# Altium schematic sheet BLE_SCH_Rev1.SchDoc
size B; CompanyName: Microchip Technology Inc.; Organization: Microchip Technology; Address1: 2355 West Chandler Blvd.; Address2: Chandler, AZ  85224; Address4: USA; SheetNumber: 1; SheetTotal: 1; SheetTitle: **; Time: Time
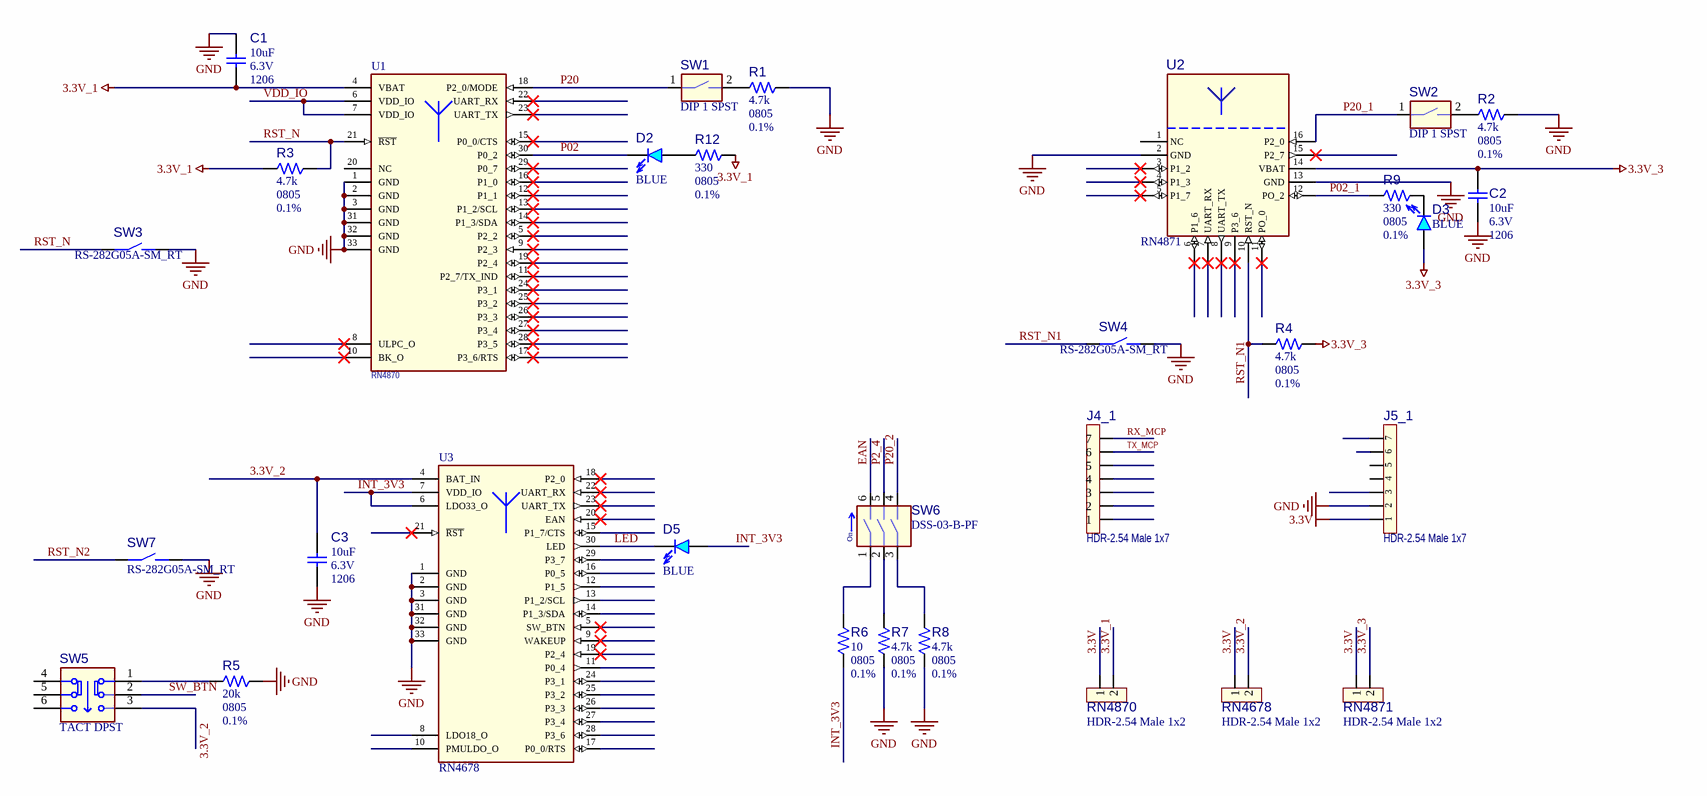
[diagram p0: BLE_SCH_Rev1.SchDoc]

## Parts
C1  value 10uF  Voltage: 6.3V  Package: 1206  [CAP_C_1206]  (hidden comment: Capacitor NP)
C2  value 10uF  Voltage: 6.3V  Package: 1206  [CAP_C_1206]  (hidden comment: Capacitor NP)
C3  value 10uF  Voltage: 6.3V  Package: 1206  [CAP_C_1206]  (hidden comment: Capacitor NP)
D2  value BLUE  [LED_0805_BLUE]  (hidden comment: LED_blue)
D3  value BLUE  [LED_0805_BLUE]  (hidden comment: LED_blue)
D5  value BLUE  [LED_0805_BLUE]  (hidden comment: LED_blue)
J4_1  value HDR-2.54 Male 1x7  [HDR_M_2.54_1x7]  (hidden comment: Header 1x7)
J5_1  value HDR-2.54 Male 1x7  [HDR_M_2.54_1x7]  (hidden comment: Header 1x7)
R1  value 4.7k  Package: 0805  Tolerance: 0.1%  [RES_C_0805]  (hidden comment: Resistor)
R2  value 4.7k  Package: 0805  Tolerance: 0.1%  [RES_C_0805]  (hidden comment: Resistor)
R3  value 4.7k  Package: 0805  Tolerance: 0.1%  [RES_C_0805]  (hidden comment: Resistor)
R4  value 4.7k  Package: 0805  Tolerance: 0.1%  [RES_C_0805]  (hidden comment: Resistor)
R5  value 20k  Package: 0805  Tolerance: 0.1%  [RES_C_0805]  (hidden comment: Resistor)
R6  value 10  Package: 0805  Tolerance: 0.1%  [RES_C_0805]  (hidden comment: Resistor)
R7  value 4.7k  Package: 0805  Tolerance: 0.1%  [RES_C_0805]  (hidden comment: Resistor)
R8  value 4.7k  Package: 0805  Tolerance: 0.1%  [RES_C_0805]  (hidden comment: Resistor)
R9  value 330  Package: 0805  Tolerance: 0.1%  [RES_C_0805]  (hidden comment: Resistor)
R12  value 330  Package: 0805  Tolerance: 0.1%  [RES_C_0805]  (hidden comment: Resistor)
RN4678  value HDR-2.54 Male 1x2  [HDR_M_2.54_1x2]  (hidden comment: Header 1x2)
RN4870  value HDR-2.54 Male 1x2  [HDR_M_2.54_1x2]  (hidden comment: Header 1x2)
RN4871  value HDR-2.54 Male 1x2  [HDR_M_2.54_1x2]  (hidden comment: Header 1x2)
SW1  value DIP 1 SPST  [SW_TH_2.54MM X 1 418117270901]  (hidden comment: Switch DIP 1 Pos)
SW2  value DIP 1 SPST  [SW_TH_2.54MM X 1 418117270901]  (hidden comment: Switch DIP 1 Pos)
SW3  value RS-282G05A-SM_RT  [SW_TACT_SMD_CK_RS-282G05A3-SM RT]  (hidden comment: Switch 2 Pin)
SW4  value RS-282G05A-SM_RT  [SW_TACT_SMD_CK_RS-282G05A3-SM RT]  (hidden comment: Switch 2 Pin)
SW5  value TACT DPST  [SW_TACT_TH_PS07-22L-PF]  (hidden comment: Switch on-off 6 Pin)
SW6  value DSS-03-B-PF  [SW_TH_2.54MM X 3 Omron]  (hidden comment: Switch DIP 3 Pos)
SW7  value RS-282G05A-SM_RT  [SW_TACT_SMD_CK_RS-282G05A3-SM RT]  (hidden comment: Switch 2 Pin)
U1  value RN4870  [MOD_BM70BLES1FC2]  (hidden comment: MODULE BM70BLES1FC2)
U2  value RN4871  [RN4871 MODULE-16]  (hidden comment: RN4871 MODULE)
U3  value RN4678  [MOD_BM78SPPS5xC2]  (hidden comment: MODULE BM78SPPS5xC2)

## Nets
3.3V: J5_1.1 RN4678.1 RN4870.1 RN4871.1
3.3V_1: C1.1 R3.2 R12.2 RN4870.2 U1.4(VBAT)
3.3V_3: C2.1 D3.1(A) R4.1 RN4871.2 U2.14(VBAT)
GND: C1.2 C2.2 C3.1 J5_1.2 R1.1 R2.1 R5.1 R7.2 R8.2 SW3.2 SW4.2 SW7.2 U1.1(GND) U1.2(GND) U1.3(GND) U1.31(GND) U1.32(GND) U1.33(GND) U2.2(GND) U2.13(GND) U3.1(GND) U3.2(GND) U3.3(GND) U3.31(GND) U3.32(GND) U3.33(GND)
3.3V_2: C3.2 RN4678.2 SW5.3 U3.4(BAT_IN)
EAN: SW6.6
INT_3V3: D5.1(A) R6.2 U3.6(LDO33_O) U3.7(VDD_IO)
LED: D5.2(K) U3.30(LED)
P02: D2.2(K) U1.30(P0_2)
P02_1: R9.1 U2.12(PO_2)
P2_4: SW6.5
P20: SW1.1 U1.18(P2_0/MODE)
P20_1: SW2.1 U2.16(P2_0)
P20_2: SW6.4
RST_N: R3.1 SW3.1 U1.21(~{RST})
RST_N1: R4.2 SW4.1 U2.10(RST_N)
RST_N2: SW7.1
RX_MCP: J4_1.7
SW_BTN: SW5.2
TX_MCP: J4_1.6
VDD_IO: U1.6(VDD_IO) U1.7(VDD_IO)
NetD2_1: D2.1(A) R12.1
NetD3_2: D3.2(K) R9.2
NetR1_2: R1.2 SW1.2
NetR2_2: R2.2 SW2.2
NetR5_2: R5.2 SW5.1
NetR6_1: R6.1 SW6.1
NetR7_1: R7.1 SW6.2
NetR8_1: R8.1 SW6.3

Not connected (* = marked no-connect by the designer): J4_1 1 2 3 4 5; J5_1 3 4 5 6 7; SW5 4 5 6; U1 5(P2_2)* 8(ULPC_O)* 9(P2_3)* 10(BK_O)* 11(P2_7/TX_IND)* 12(P1_1)* 13(P1_2/SCL)* 14(P1_3/SDA)* 15(P0_0/CTS)* 16(P1_0)* 17(P3_6/RTS)* 19(P2_4)* 20(NC) 22(UART_RX)* 23(UART_TX)* 24(P3_1)* 25(P3_2)* 26(P3_3)* 27(P3_4)* 28(P3_5)* 29(P0_7)*; U2 1(NC) 3(P1_2)* 4(P1_3)* 5(P1_7)* 6(P1_6)* 7(UART_RX)* 8(UART_TX)* 9(P3_6)* 11(PO_0)* 15(P2_7)*; U3 5(SW_BTN)* 8(LDO18_O) 9(WAKEUP)* 10(PMULDO_O) 11(P0_4) 12(P1_5) 13(P1_2/SCL) 14(P1_3/SDA) 15(P1_7/CTS) 16(P0_5) 17(P0_0/RTS) 18(P2_0)* 19(P2_4)* 20(EAN)* 21(~{RST})* 22(UART_RX)* 23(UART_TX)* 24(P3_1) 25(P3_2) 26(P3_3) 27(P3_4) 28(P3_6) 29(P3_7)

## Notes on the sheet
- Project Owner:
- PCB Layout Contact:
- PartNumber:
- Project Title
- Variant:
- Sheet Title
- Size
- B
- SCH #:
- PCB #:
- Rev:
- Date:
- Sheet
- Designed with
- Altium.com <http://go.altium.com/MicrochipLandingPage_Evaluation.html>
- File:
- (in symbol SWITCH1042) On

## Library data of the parts
C1-C3 = CAP0461: Manufacturer 1: Murata; Manufacturer Part Number 1: GRM31CR60J107ME39L; Description_: CAP CER 100uF 6.3V 20% X5R SMD 1206; Dev Tools Status: Production; Tolerance: 20%; Temperature Coefficient: X5R; Type: Ceramic; Populated: Yes; MCHP-ID: CAP0461; Revision: 1; Symbol: Capacitor NP; Status: MCL Design; ComponentLink1URL: https://chn-vm-apps.microchip.com/mchprepo/parts/Datasheets/L0005E.pdf; ComponentLink1Description: SVN Datasheet; ComponentLink2URL: C:\ALTIUM_WORK\00001_MCHP-CDB\Datasheets\L0005E.pdf; ComponentLink2Description: Local Datasheet; ComponentLink3URL: C:\ALTIUM_WORK\00001_MCHP-CDB\Library\LibraryRefs\Capacitor NP.SchLib; ComponentLink3Description: Open Symbol; ComponentLink4URL: C:\ALTIUM_WORK\00001_MCHP-CDB\Library\Footprints\CAP_C_1206.PcbLib; ComponentLink4Description: Open Footprint; ComponentLink5Description: Open Footprint 2; ComponentLink6Description: Open Footprint 3; ComponentLink7Description: Open Footprint 4; Operating Temperature: -55C to +85C; Category: Capacitor; Manufacturer 2: Taiyo Yuden; Manufacturer Part Number 2: JMK316BJ107ML-T; Supplier 1: Digi-Key; Supplier Part Number 1: 490-4539-1-ND; Supplier 2: Digi-Key; Supplier Part Number 2: 587-1963-1-ND; Quantity Override: 1
D2 D3 D5 = DIODE1080: LED; MCHP-ID: DIODE1080
J4_1 = CON0448: Manufacturer 1: Wurth Electronics Inc; Manufacturer Part Number 1: 61300711121; Description_: CON HDR-2.54 Male 1x7 Gold 5.84MH TH VERT; Dev Tools Status: Production; Populated: Yes; MCHP-ID: CON0448; Revision: 1; Symbol: Header 1x7; Status: MCL Design; ComponentLink1URL: https://chn-vm-apps.microchip.com/mchprepo/parts/Datasheets/TSW-XXX-XX-XXX-X-XX-XXX-MKT.pdf; ComponentLink1Description: SVN Datasheet; ComponentLink2URL: C:\ALTIUM_WORK\00001_MCHP-CDB\Datasheets\TSW-XXX-XX-XXX-X-XX-XXX-MKT.pdf; ComponentLink2Description: Local Datasheet; ComponentLink3URL: C:\ALTIUM_WORK\00001_MCHP-CDB\Library\LibraryRefs\Header 1x7.SchLib; ComponentLink3Description: Open Symbol; ComponentLink4URL: C:\ALTIUM_WORK\00001_MCHP-CDB\Library\Footprints\HDR_M_2.54_1x7.PcbLib; ComponentLink4Description: Open Footprint; ComponentLink5Description: Open Footprint 2; ComponentLink6Description: Open Footprint 3; ComponentLink7Description: Open Footprint 4; Type: Header 2.54mm; Category: Connector; Manufacturer 2: Samtec; Manufacturer Part Number 2: TSW-107-07-S-S; Manufacturer 3: Samtec; Manufacturer Part Number 3: TSW-107-07-G-S; Supplier 1: Digi-Key; Supplier Part Number 1: 732-5320-ND; Supplier 2: Digi-Key; Supplier Part Number 2: SAM1033-07-ND; Supplier 3: Samtec; Supplier Part Number 3: TSW-107-07-G-S; Quantity Override: 1
J5_1 = CON0448: Manufacturer 1: Samtec; Manufacturer Part Number 1: TSW-107-07-S-S; Description_: CON HDR-2.54 Male 1x7 Gold 5.84MH TH VERT; Populated: Yes; MCHP-ID: CON0448; Revision: 1; Status: Production; ComponentLink1URL: https://chn-vm-apps.microchip.com/mchprepo/parts/Datasheets/TSW-XXX-XX-XXX-X-XX-XXX-MKT.pdf; ComponentLink1Description: Datasheet; Type: Header 2.54mm; Category: Connector; Manufacturer 2: Samtec; Manufacturer Part Number 2: TSW-107-07-G-S; Supplier 1: Samtec; Supplier Part Number 1: TSW-107-07-S-S; Supplier 2: Samtec; Supplier Part Number 2: TSW-107-07-G-S; Quantity Override: 1
R1-R9 R12 = RES1372: MCHP-ID: RES1372
RN4678 RN4870 RN4871 = CON1312: Manufacturer 1: Sullins Connector Solutions; Manufacturer Part Number 1: PREC002SAAN-RC; Description_: CON HDR-2.54 Male 1x2 Tin 5.84MH TH VERT; Dev Tools Status: Production; Owner: Randolph Sobrepena; Populated: YES; Restricted Sourcing: No; MCHP-ID: CON1312; Revision: 3; Symbol: Header 1x2; Status: MCL Design; ComponentLink1URL: https://chn-vm-apps.microchip.com/mchprepo/parts/Datasheets/z RzCzzzSzzN-RC, ST,11635-B.pdf; ComponentLink1Description: SVN Datasheet; ComponentLink2URL: C:\ALTIUM_WORK\00001_MCHP-CDB\Datasheets\z RzCzzzSzzN-RC, ST,11635-B.pdf; ComponentLink2Description: Local Datasheet; ComponentLink3URL: C:\ALTIUM_WORK\00001_MCHP-CDB\Library\LibraryRefs\Header 1x2.SchLib; ComponentLink3Description: Open Symbol; ComponentLink4URL: C:\ALTIUM_WORK\00001_MCHP-CDB\Library\Footprints\HDR_M_2.54_1x2.PcbLib; ComponentLink4Description: Open Footprint; ComponentLink5Description: Open Footprint 2; ComponentLink6Description: Open Footprint 3; ComponentLink7Description: Open Footprint 4; Type: Header 2.54mm; Category: Connector; Manufacturer 2: SHENZHEN JUNHAO ENGINEERING; Manufacturer Part Number 2: R-211-0211-0021-000; Supplier 1: Digi-Key; Supplier Part Number 1: S1012EC-02-ND; Supplier 2: SHENZHEN JUNHAO ENGINEERING; Supplier Part Number 2: R-211-0211-0021-000; Quantity Override: 1
SW1 SW2 = SWITCH1055: Manufacturer 1: Würth Elektronik; Manufacturer Part Number 1: 418117270901; Description_: SWITCH DIP 1 SPST 24V 25mA 418117270901 TH; Dev Tools Status: Production; Owner: Gabor Bihari; Voltage: 24V; Current: 25mA; Populated: YES; MCHP-ID: SWITCH1055; Revision: 2; Symbol: Switch DIP 1 Pos; Status: MCL Design; ComponentLink1URL: https://chn-vm-apps.microchip.com/mchprepo/parts/Datasheets/4181172709xx.pdf; ComponentLink1Description: SVN Datasheet; ComponentLink2URL: C:\ALTIUM_WORK\00001_MCHP-CDB\Datasheets\4181172709xx.pdf; ComponentLink2Description: Local Datasheet; ComponentLink3URL: C:\ALTIUM_WORK\00001_MCHP-CDB\Library\LibraryRefs\Switch DIP 1 Pos.SchLib; ComponentLink3Description: Open Symbol; ComponentLink4URL: C:\ALTIUM_WORK\00001_MCHP-CDB\Library\Footprints\SW_TH_2.54MM X 1 418117270901.PcbLib; ComponentLink4Description: Open Footprint; ComponentLink5Description: Open Footprint 2; ComponentLink6Description: Open Footprint 3; ComponentLink7Description: Open Footprint 4; Operating Temperature: -40°C to 85°C; Category: Switch; Type: DIP; Supplier 1: Digi-Key; Supplier Part Number 1: 732-3831-5-ND; Quantity Override: 1
SW3 SW4 SW7 = SWITCH1057: Switch; Manufacturer 1: C&K; Manufacturer Part Number 1: KSR211GLFS; Description_: SWITCH TACT SPST 12V 50mA RS-282G05A3-SM RT; Dev Tools Status: Production; Owner: Gabor Bihari; Voltage: 12V; Current: 50mA; Populated: YES; MCHP-ID: SWITCH1057; Revision: 2; Symbol: Switch 2 Pin; Status: MCL Design; ComponentLink1URL: https://chn-vm-apps.microchip.com/mchprepo/parts/Datasheets/RS-282G05A-SM_RT.pdf; ComponentLink1Description: SVN Datasheet; ComponentLink2URL: C:\ALTIUM_WORK\00001_MCHP-CDB\Datasheets\RS-282G05A-SM_RT.pdf; ComponentLink2Description: Local Datasheet; ComponentLink3URL: C:\ALTIUM_WORK\00001_MCHP-CDB\Library\LibraryRefs\Switch 2 Pin.SchLib; ComponentLink3Description: Open Symbol; ComponentLink4URL: C:\ALTIUM_WORK\00001_MCHP-CDB\Library\Footprints\SW_TACT_SMD_CK_RS-282G05A3-SM RT.PcbLib; ComponentLink4Description: Open Footprint; ComponentLink5Description: Open Footprint 2; ComponentLink6Description: Open Footprint 3; ComponentLink7Description: Open Footprint 4; Category: Switch; Type: Tactile; Manufacturer 2: C&K Components; Manufacturer Part Number 2: RS-282G05A3-SM RT; Supplier 1: C&K; Supplier Part Number 1: KSR211GLFS; Supplier 2: Digi-Key; Supplier Part Number 2: CKN10384CT-ND; Quantity Override: 1
SW5 = SWITCH1041: PS-5177; Manufacturer 1: E-Switch; Manufacturer Part Number 1: TL2230OAF140; Description_: SWITCH TACTILE PUSH ON-OFF 6 PIN; Dev Tools Status: Production; Owner: Duane Burt; Populated: YES; MCHP-ID: SWITCH1041; Revision: 2; Symbol: Switch on-off 6 Pin; Status: MCL Design; ComponentLink1Description: SVN Datasheet; ComponentLink2Description: Local Datasheet; ComponentLink3URL: C:\ALTIUM_WORK\00001_MCHP-CDB\Library\LibraryRefs\Switch on-off 6 Pin.SchLib; ComponentLink3Description: Open Symbol; ComponentLink4URL: C:\ALTIUM_WORK\00001_MCHP-CDB\Library\Footprints\SW_TACT_TH_PS07-22L-PF.PcbLib; ComponentLink4Description: Open Footprint; ComponentLink5Description: Open Footprint 2; ComponentLink6Description: Open Footprint 3; ComponentLink7Description: Open Footprint 4; Category: Switch; Type: Tactile; Supplier 1: E-Switch; Supplier Part Number 1: TL2230OAF140; Quantity Override: 1
SW6 = SWITCH1042: Switch DIP; Manufacturer 1: C&K; Manufacturer Part Number 1: BDB03; Description_: SWITCH DIP 3 SPST 24VDC 25MA DSS-03-B-PF TH; Dev Tools Status: Production; Owner: Duane Burt; Populated: YES; MCHP-ID: SWITCH1042; Revision: 4; Symbol: Switch DIP 3 Pos; Status: MCL Design; ComponentLink1Description: SVN Datasheet; ComponentLink2Description: Local Datasheet; ComponentLink3URL: C:\ALTIUM_WORK\00001_MCHP-CDB\Library\LibraryRefs\Switch DIP 3 Pos.SchLib; ComponentLink3Description: Open Symbol; ComponentLink4URL: C:\ALTIUM_WORK\00001_MCHP-CDB\Library\Footprints\SW_TH_2.54MM X 3 Omron.PcbLib; ComponentLink4Description: Open Footprint; ComponentLink5Description: Open Footprint 2; ComponentLink6Description: Open Footprint 3; ComponentLink7Description: Open Footprint 4; Category: Switch; Type: DIP; Manufacturer 2: DIPTRONICS MANUFACTURING INC; Manufacturer Part Number 2: NDS-03V; Manufacturer 3: ROKI ELECTRONICS CO., LTD.; Manufacturer Part Number 3: DSS-03-B-PF; Manufacturer 4: C&K; Manufacturer Part Number 4: BD03; Supplier 1: Digi-Key; Supplier Part Number 1: CKN12078-ND; Supplier 2: Mouser; Supplier Part Number 2: 113-NDS03V; Supplier 3: ROKI ELECTRONICS CO., LTD.; Supplier Part Number 3: DSS-03-B-PF; Supplier 4: Digi-Key; Supplier Part Number 4: CKN3002-ND; Quantity Override: 1
U1 = MIC6594: Manufacturer 1: Microchip Technology Inc; Manufacturer Part Number 1: RN4870-V/RM118; Description_: MCHP RF BLUETOOTH RN4870-V/RM118 MODULE-33; Dev Tools Status: Production; Owner: Jojie Batislaon; Populated: YES; MCHP-ID: MIC6594; Symbol: MODULE BM70BLES1FC2; Type: Bluetooth; Status: MCL Design; Revision: 1; Category: MCHP-Wireless; ComponentLink1URL: https://www.microchip.com/sitesearch/search/Product%20and%20Development%20Tools/RN4870-V/RM118; ComponentLink1Description: SVN Datasheet; ComponentLink2Description: Local Datasheet; ComponentLink3URL: C:\ALTIUM_WORK\00001_MCHP-CDB\Library\LibraryRefs\MODULE BM70BLES1FC2.SchLib; ComponentLink3Description: Open Symbol; ComponentLink4URL: C:\ALTIUM_WORK\00001_MCHP-CDB\Library\Footprints\MOD_BM70BLES1FC2.PcbLib; ComponentLink4Description: Open Footprint; ComponentLink5Description: Open Footprint 2; ComponentLink6Description: Open Footprint 3; ComponentLink7Description: Open Footprint 4; Supplier 1: Microchip Technology Inc; Supplier Part Number 1: RN4870-V/RM118; Quantity Override: 1; Operating Temperature: -20C to +70C
U2 = MIC8998: Manufacturer 1: Microchip Technology; Manufacturer Part Number 1: RN4871-I/RM130; Description_: MCHP RF BLUETOOTH RN4871-I/RM130; Dev Tools Status: Production; Owner: Octavian Stroe; Populated: YES; MCHP-ID: MIC8998; Symbol: RN4871 MODULE; Type: Bluetooth; Status: MCL Design; Revision: A; Category: MCHP-Wireless; ComponentLink1URL: https://chn-vm-apps.microchip.com/mchprepo/parts/Datasheets/50002489C.pdf; ComponentLink1Description: SVN Datasheet; ComponentLink2URL: C:\ALTIUM_WORK\00001_MCHP-CDB\Datasheets\50002489C.pdf; ComponentLink2Description: Local Datasheet; ComponentLink3URL: C:\ALTIUM_WORK\00001_MCHP-CDB\Library\LibraryRefs\RN4871 MODULE.SchLib; ComponentLink3Description: Open Symbol; ComponentLink4URL: C:\ALTIUM_WORK\00001_MCHP-CDB\Library\Footprints\RN4871 MODULE-16.PcbLib; ComponentLink4Description: Open Footprint; ComponentLink5Description: Open Footprint 2; ComponentLink6Description: Open Footprint 3; ComponentLink7Description: Open Footprint 4; Supplier 1: Digi-Key; Supplier Part Number 1: RN4871-I/RM130-ND; Quantity Override: 1; Operating Temperature: -40C to +85C
U3 = MIC6625: Manufacturer 1: Microchip Technology; Manufacturer Part Number 1: RN4678-V/RM122; Description_: MCHP RF BLUETOOTH RN4678-V/RM MODULE-33; Dev Tools Status: Production; Owner: Jojie Batislaon; Populated: YES; MCHP-ID: MIC6625; Symbol: MODULE BM78SPPS5xC2; Type: Bluetooth; Status: MCL Design; Revision: 3; Category: MCHP-Wireless; ComponentLink1URL: https://www.microchip.com/sitesearch/search/Product%20and%20Development%20Tools/RN4678-V/RM122; ComponentLink1Description: SVN Datasheet; ComponentLink2Description: Local Datasheet; ComponentLink3URL: C:\ALTIUM_WORK\00001_MCHP-CDB\Library\LibraryRefs\MODULE BM78SPPS5xC2.SchLib; ComponentLink3Description: Open Symbol; ComponentLink4URL: C:\ALTIUM_WORK\00001_MCHP-CDB\Library\Footprints\MOD_BM78SPPS5xC2.PcbLib; ComponentLink4Description: Open Footprint; ComponentLink5Description: Open Footprint 2; ComponentLink6Description: Open Footprint 3; ComponentLink7Description: Open Footprint 4; Supplier 1: Microchip Technology; Supplier Part Number 1: RN4678-V/RM122; Quantity Override: 1